# Altium schematic sheet 通信.SchDoc
size A4
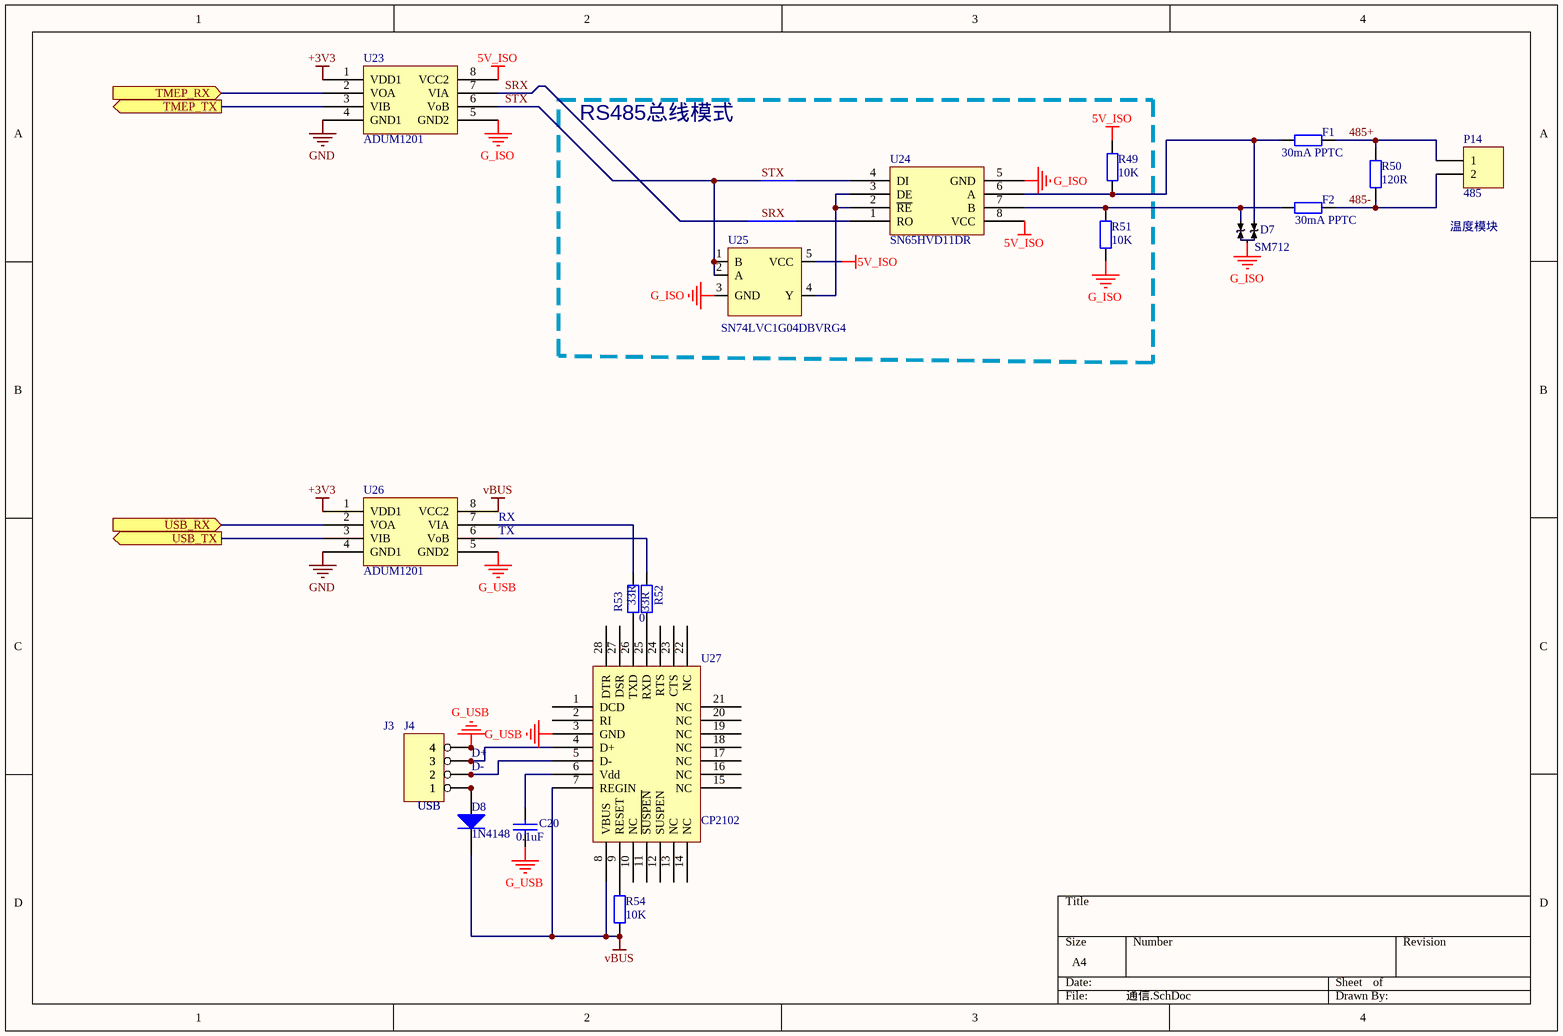
[diagram p0: 通信.SchDoc]

## Parts
C20  0.1uF  [1608C]
D7  SM712  [sot-23]
D8  1N4148  [SOD-123]
F1  30mA PPTC  [1608]
F2  30mA PPTC  [1608]
J3  USB  [ch2.5/4]
J4  USB  [USB-A-M]
P14  485  [5264-2]
R49  10K  [1608]
R50  120R  [1608]
R51  10K  [1608]
R52  33R  [1608]
R53  33R  value 0  [1608]
R54  10K  [1608]
U23  ADUM1201  [so8]
U24  SN65HVD11DR  [so8]
U25  SN74LVC1G04DBVRG4  [sot-23-5]
U26  ADUM1201  [so8]
U27  CP2102  [QFN-28]

## Blocks framed on the sheet
RS485总线模式: R49 R51 U24 U25

## Ports
TMEP_RX (in), TMEP_TX (out), USB_RX (in), USB_TX (out)

## Nets
5V_ISO: R49.1 U23.8(VCC2) U24.8(VCC) U25.5(VCC)
+3V3: U23.1(VDD1) U26.1(VDD1)
G_ISO: D7.3(COM) R51.1 U23.5(GND2) U24.5(GND) U25.3(GND)
G_USB: C20.2 J3.4 J4.4 U26.5(GND2) U27.3(GND)
GND: U23.4(GND1) U26.4(GND1)
vBUS: D8.2(K) R54.2 U26.8(VCC2) U27.7(REGIN) U27.8(VBUS)
485+: F1.1 P14.1 R50.2
485-: F2.1 P14.2 R50.1
SRX: U23.7(VIA) U24.1(RO)
STX: U23.6(VoB) U24.4(DI) U25.1(B) U25.2(A)
TMEP_RX: U23.2(VOA) ; port TMEP_RX
TMEP_TX: U23.3(VIB) ; port TMEP_TX
USB_RX: U26.2(VOA) ; port USB_RX
USB_TX: U26.3(VIB) ; port USB_TX
NetC20_1: C20.1 U27.6(Vdd)
NetD7_1: D7.1(Red) F2.2 R51.2 U24.7(B)
NetD7_2: D7.2(Blue) F1.2 R49.2 U24.6(A)
NetD8_1: D8.1(A) J3.1 J4.1
NetJ3_2: J3.2 J4.2 U27.5(D-)
NetJ3_3: J3.3 J4.3 U27.4(D+)
NetR52_1: R52.1 U27.25(RXD)
NetR52_2: R52.2 U26.6(VoB)
NetR53_1: R53.1 U27.26(TXD)
NetR53_2: R53.2 U26.7(VIA)
NetR54_1: R54.1 U27.9(RESET)
NetU24_2: U24.2(~{RE}) U24.3(DE) U25.4(Y)

Not connected (* = marked no-connect by the designer): U27 1(DCD) 2(RI) 10(NC) 11(~{SUSPEN}) 12(SUSPEN) 13(NC) 14(NC) 15(NC) 16(NC) 17(NC) 18(NC) 19(NC) 20(NC) 21(NC) 22(NC) 23(CTS) 24(RTS) 27(DSR) 28(DTR)

## Notes on the sheet
- (near P14) 温度模块
- (near U26) RX
- (near U26) TX
- D-
- D+

## Library data of the parts
C20 = CAP: Capacitor
D7 = NUP2105L-D
D8 = Diode: Default Diode; Published: 8-Jun-2000; LatestRevisionDate: 17-Jul-2002; LatestRevisionNote: Re-released for DXP Platform.; PackageDocument: Sep-1996; PackageReference: SMC; Publisher: Altium Limited; Code_JEDEC: DO-214-AB
F1 F2 = Res2: Resistor; Value: 5K6; Published: 8-Jun-2000; LatestRevisionDate: 17-Jul-2002; LatestRevisionNote: Re-released for DXP Platform.; PackageReference: 2012; Publisher: Altium Limited
J3 J4 = 4 HEADER: 4 Pin Header
P14 = Header 2: Header, 2-Pin; LatestRevisionDate: 17-Jul-2002; LatestRevisionNote: Re-released for DXP Platform.; Publisher: Altium Limited
R49 R51 = Res2: Resistor; Value: 1K2; Published: 8-Jun-2000; LatestRevisionDate: 17-Jul-2002; LatestRevisionNote: Re-released for DXP Platform.; PackageReference: AXIAL-0.4; Publisher: Altium Limited
R50 R52-R54 = Res2: Resistor; Published: 8-Jun-2000; LatestRevisionDate: 17-Jul-2002; LatestRevisionNote: Re-released for DXP Platform.; PackageReference: AXIAL-0.4; Publisher: Altium Limited
  R54: Value: 10K
U23 U24 U26 = max485
U25 = LMV321
U27 = Component_1